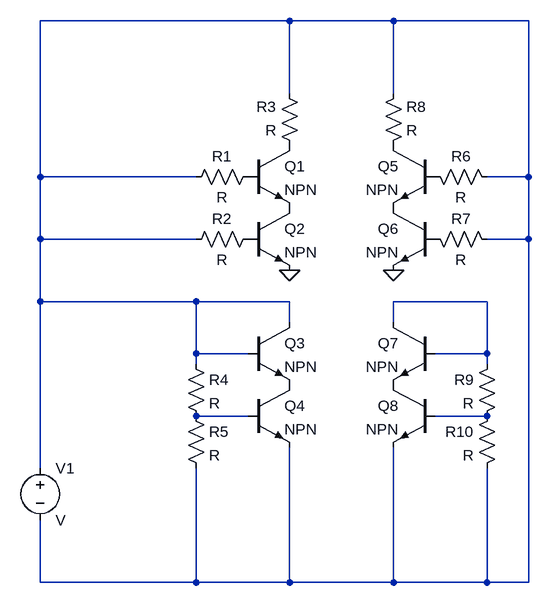
[diagram p0: schematic completed alternating offset mirror device.asc]
completed alternating offset mirror device.asc, the LTspice schematic file:
Version 4.1
SHEET 1 880 680
WIRE 288 -432 -96 -432
WIRE 448 -432 288 -432
WIRE 656 -432 448 -432
WIRE 288 -320 288 -432
WIRE 448 -320 448 -432
WIRE -96 -192 -96 -432
WIRE 144 -192 -96 -192
WIRE 656 -192 656 -432
WIRE 656 -192 592 -192
WIRE -96 -96 -96 -192
WIRE 144 -96 -96 -96
WIRE 656 -96 656 -192
WIRE 656 -96 592 -96
WIRE -96 0 -96 -96
WIRE 144 0 -96 0
WIRE 288 0 144 0
WIRE 592 0 448 0
WIRE 288 32 288 0
WIRE 448 32 448 0
WIRE 144 80 144 0
WIRE 224 80 144 80
WIRE 592 80 592 0
WIRE 592 80 512 80
WIRE 144 96 144 80
WIRE 592 96 592 80
WIRE 224 176 144 176
WIRE 592 176 512 176
WIRE -96 256 -96 0
WIRE -96 432 -96 336
WIRE 144 432 144 256
WIRE 144 432 -96 432
WIRE 288 432 288 224
WIRE 288 432 144 432
WIRE 448 432 448 224
WIRE 448 432 288 432
WIRE 592 432 592 256
WIRE 592 432 448 432
WIRE 656 432 656 -96
WIRE 656 432 592 432
FLAG 288 -48 0
FLAG 448 -48 0
SYMBOL npn 224 -240 R0
SYMATTR InstName Q1
SYMBOL npn 224 -144 R0
SYMATTR InstName Q2
SYMBOL npn 224 32 R0
SYMATTR InstName Q3
SYMBOL npn 224 128 R0
SYMATTR InstName Q4
SYMBOL res 240 -208 R90
WINDOW 0 0 56 VBottom 2
WINDOW 3 32 56 VTop 2
SYMATTR InstName R1
SYMBOL res 240 -112 R90
WINDOW 0 0 56 VBottom 2
WINDOW 3 32 56 VTop 2
SYMATTR InstName R2
SYMBOL res 304 -224 R180
WINDOW 0 36 76 Left 2
WINDOW 3 36 40 Left 2
SYMATTR InstName R3
SYMBOL voltage -96 240 R0
SYMATTR InstName V1
SYMBOL res 128 80 R0
SYMATTR InstName R4
SYMBOL res 128 160 R0
SYMATTR InstName R5
SYMBOL npn 512 -240 M0
SYMATTR InstName Q5
SYMBOL npn 512 -144 M0
SYMATTR InstName Q6
SYMBOL npn 512 32 M0
SYMATTR InstName Q7
SYMBOL npn 512 128 M0
SYMATTR InstName Q8
SYMBOL res 496 -208 M90
WINDOW 0 0 56 VBottom 2
WINDOW 3 32 56 VTop 2
SYMATTR InstName R6
SYMBOL res 496 -112 M90
WINDOW 0 0 56 VBottom 2
WINDOW 3 32 56 VTop 2
SYMATTR InstName R7
SYMBOL res 432 -224 M180
WINDOW 0 36 76 Left 2
WINDOW 3 36 40 Left 2
SYMATTR InstName R8
SYMBOL res 608 80 M0
SYMATTR InstName R9
SYMBOL res 608 160 M0
SYMATTR InstName R10

The netlist it stands for:
* completed alternating offset mirror device.asc
Q1 P001 P002 P003 0 NPN
Q2 P003 P004 0 0 NPN
Q3 N001 N001 P005 0 NPN
Q4 P005 N003 N001 0 NPN
R1 P002 N001 R
R2 P004 N001 R
R3 P001 N001 R
V1 N001 N001 V
R4 N001 N003 R
R5 N003 N001 R
Q5 P006 P007 P008 0 NPN
Q6 P008 P009 0 0 NPN
Q7 N002 N002 P010 0 NPN
Q8 P010 N004 N001 0 NPN
R6 P007 N001 R
R7 P009 N001 R
R8 P006 N001 R
R9 N002 N004 R
R10 N004 N001 R
.model NPN NPN
.model PNP PNP
.lib standard.bjt
.backanno
.end